# Altium schematic sheet comms_block_diagram.SchDoc: Transceiver Board Block Diagram
size A; CompanyName: UCI CubeSat; Engineer: Jonathan Lin; Revision: 1; SheetNumber: 2; SheetTotal: 3
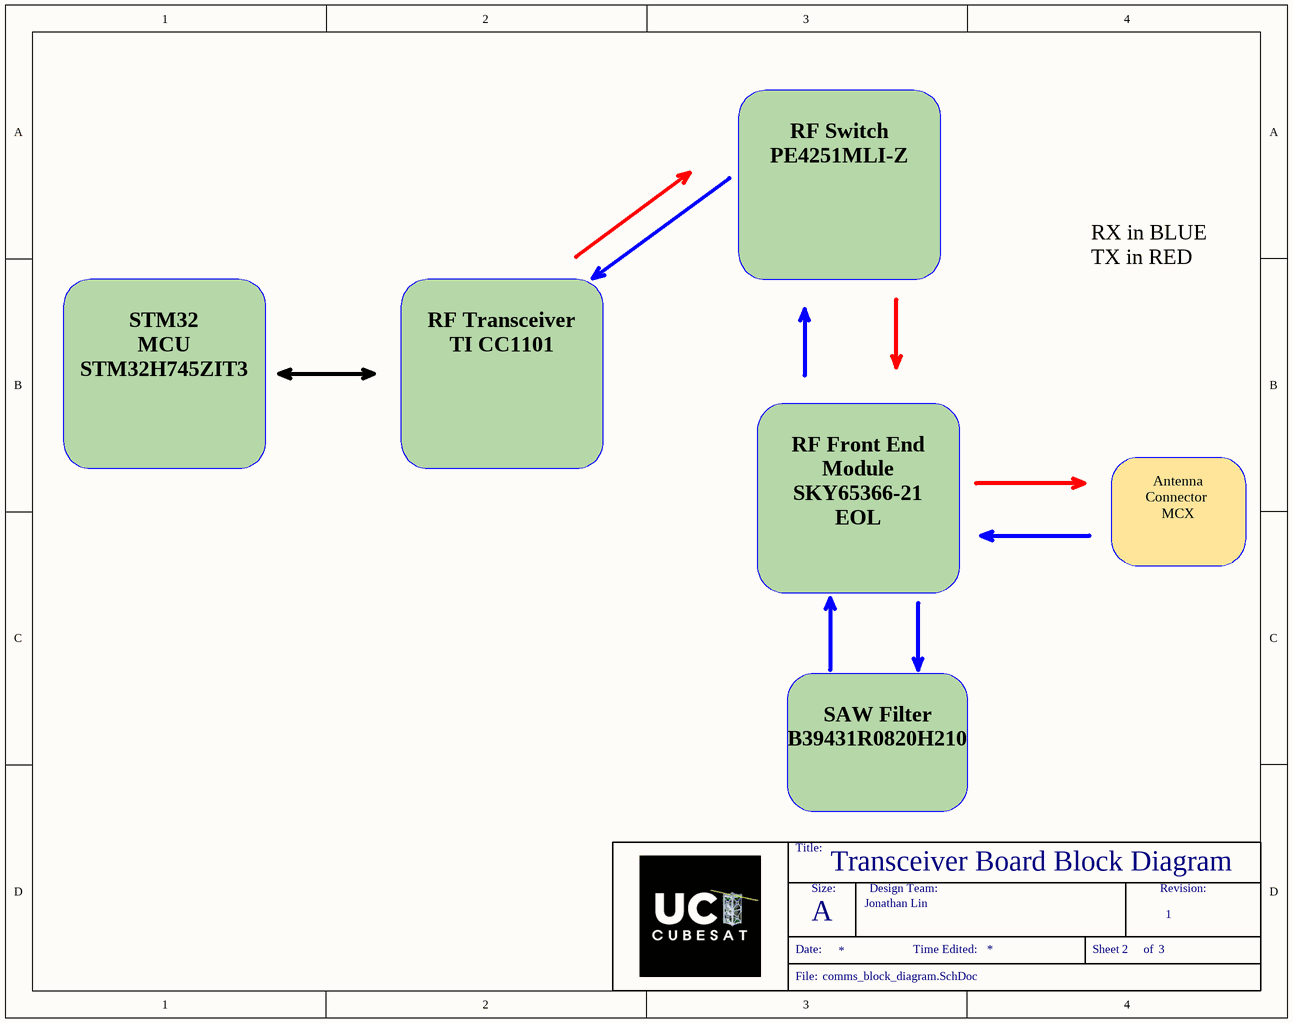
[diagram p0: comms_block_diagram.SchDoc]

## Notes on the sheet
- RF Switch
  PE4251MLI-Z
- RX in BLUE
  TX in RED
- STM32
  MCU
  STM32H745ZIT3
- RF Transceiver
  TI CC1101
- Antenna
  Connector
  MCX
- RF Front End Module
  SKY65366-21
  EOL
- SAW Filter
  B39431R0820H210
- Title:
- Size:
- Design Team:
- Revision:
- Date:
- A
- Time Edited:
- Sheet
- of
- File: